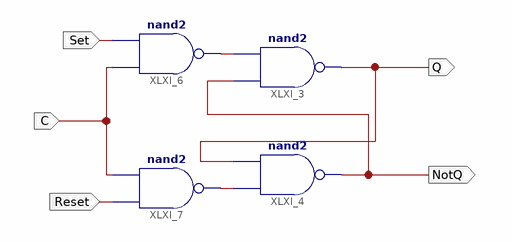
[diagram p0: schematic sheet 1]
// Xilinx ISE schematic CSR_Latch.sch (kintex7) as structural Verilog: 4 symbols, 5 ports
module CSR_Latch (
  input  Set,
  input  Reset,
  input  C,
  output Q,
  output NotQ
);

  wire r, s;

  nand XLXI_3 (Q, NotQ, s);
  nand XLXI_4 (NotQ, r, Q);
  nand XLXI_6 (s, C, Set);
  nand XLXI_7 (r, Reset, C);
endmodule
